# EAGLE design cbm_usb_v1.0a (EAGLE 6.4)

## Sheet 1 of 3
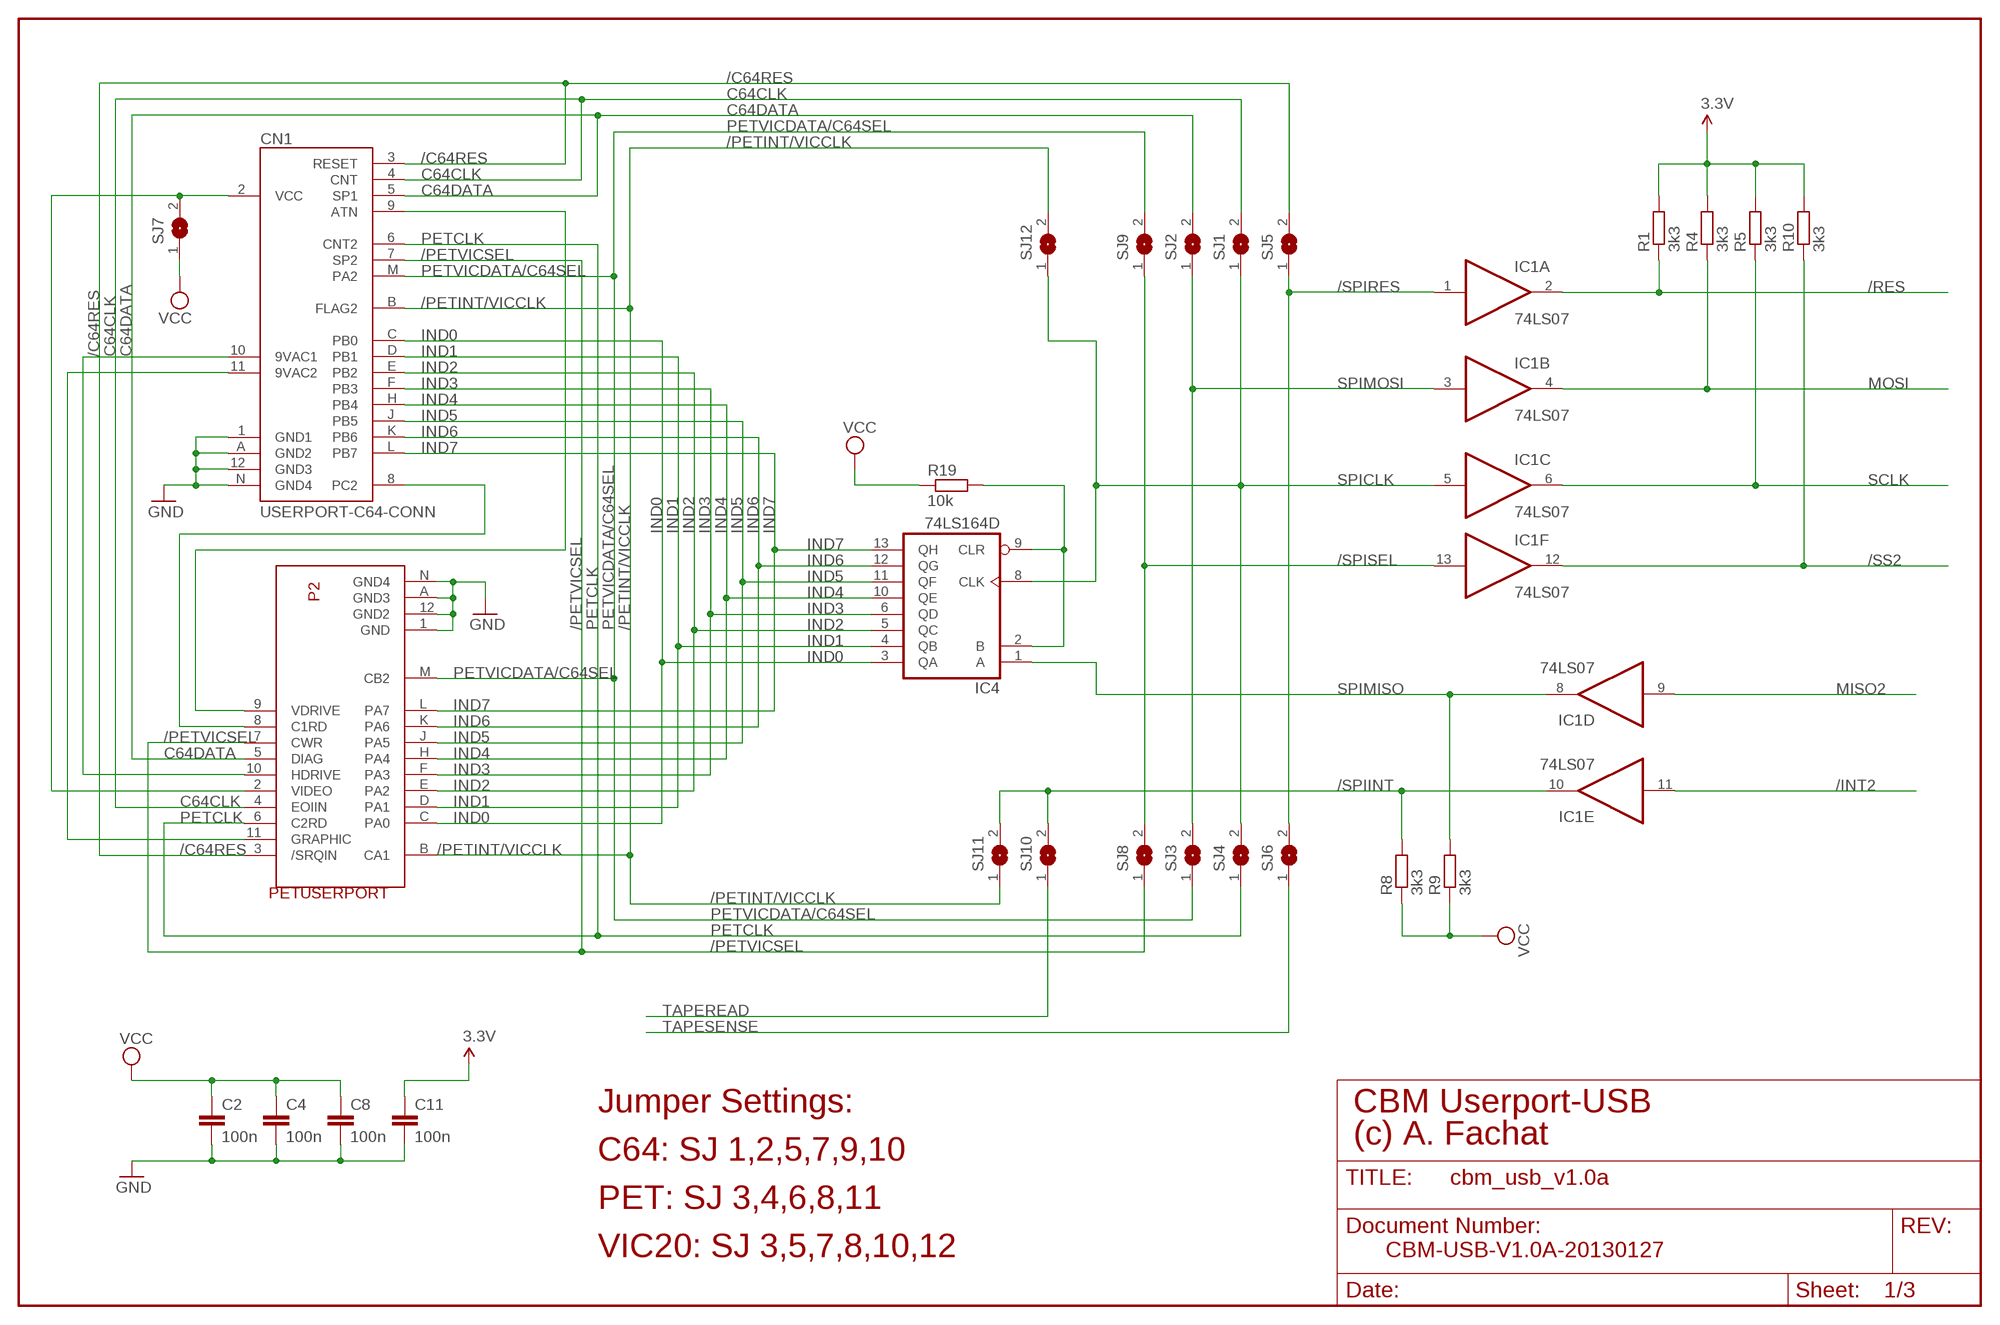
[diagram p0: schematic, sheet 1]

### Parts
C2  100n  C-EU050-025X075  [C050-025X075]
C4  100n  C-EU050-025X075  [C050-025X075]
C8  100n  C-EU050-025X075  [C050-025X075]
C11  100n  C-EU050-025X075  [C050-025X075]
CN1  USERPORT-C64-CONN  [UPS24CONN]
IC1  74LS07  74LS07D  [SO14]
IC4  74LS164D  [SO14]
P2  PETUSERPORT  [FLAT24]
R1  3k3  R-EU_0204/7  [0204/7]
R4  3k3  R-EU_0204/7  [0204/7]
R5  3k3  R-EU_0204/7  [0204/7]
R8  3k3  R-EU_0204/7  [0204/7]
R9  3k3  R-EU_0204/7  [0204/7]
R10  3k3  R-EU_0204/7  [0204/7]
R19  10k  R-EU_0204/7  [0204/7]
SJ1  SJW  [SJW]
SJ2  SJW  [SJW]
SJ3  SJW  [SJW]
SJ4  SJW  [SJW]
SJ5  SJW  [SJW]
SJ6  SJW  [SJW]
SJ7  SJW  [SJW]
SJ8  SJW  [SJW]
SJ9  SJW  [SJW]
SJ10  SJW  [SJW]
SJ11  SJW  [SJW]
SJ12  SJW  [SJW]

### Nets
3.3V: C11.1 R1.2 R4.2 R5.2 R10.2 ; also sheet 2,3
/C64RES: CN1.3(RESET) P2.3(/SRQIN) SJ5.2
/INT2: IC1.11(E:I) ; also sheet 2
/PETINT/VICCLK: CN1.B(FLAG2) P2.B(CA1) SJ11.1 SJ12.2
/PETVICSEL: CN1.7(SP2) P2.7(CWR) SJ8.1
/RES: IC1.2(A:O) R1.1 ; also sheet 2
/SPIINT: IC1.10(E:O) R8.2 SJ10.2 SJ11.2
/SPIRES: IC1.1(A:I) SJ5.1 SJ6.2
/SPISEL: IC1.13(F:I) SJ8.2 SJ9.1
/SS2: IC1.12(F:O) R10.1 ; also sheet 2
C64CLK: CN1.4(CNT) P2.4(EOIIN) SJ1.2
C64DATA: CN1.5(SP1) P2.5(DIAG) SJ2.2
GND: C2.2 C4.2 C8.2 C11.2 CN1.1(GND1) CN1.12(GND3) CN1.A(GND2) CN1.N(GND4) P2.1(GND) P2.12(GND2) P2.A(GND3) P2.N(GND4) ; also sheet 2,3
IND0: CN1.C(PB0) IC4.3(QA) P2.C(PA0)
IND1: CN1.D(PB1) IC4.4(QB) P2.D(PA1)
IND2: CN1.E(PB2) IC4.5(QC) P2.E(PA2)
IND3: CN1.F(PB3) IC4.6(QD) P2.F(PA3)
IND4: CN1.H(PB4) IC4.10(QE) P2.H(PA4)
IND5: CN1.J(PB5) IC4.11(QF) P2.J(PA5)
IND6: CN1.K(PB6) IC4.12(QG) P2.K(PA6)
IND7: CN1.L(PB7) IC4.13(QH) P2.L(PA7)
MISO2: IC1.9(D:I) ; also sheet 2
MOSI: IC1.4(B:O) R4.1 ; also sheet 2
N$1: CN1.10(9VAC1) P2.10(HDRIVE)
N$2: CN1.11(9VAC2) P2.11(GRAPHIC)
N$5: CN1.2(VCC) P2.2(VIDEO) SJ7.2
N$6: CN1.8(PC2) P2.8(C1RD)
N$7: CN1.9(ATN) P2.9(VDRIVE)
N$37: IC4.2(B) IC4.9(CLR) R19.2
PETCLK: CN1.6(CNT2) P2.6(C2RD) SJ4.1
PETVICDATA/C64SEL: CN1.M(PA2) P2.M(CB2) SJ3.1 SJ9.2
SCLK: IC1.6(C:O) R5.1 ; also sheet 2
SPICLK: IC1.5(C:I) IC4.8(CLK) SJ1.1 SJ4.2 SJ12.1
SPIMISO: IC1.8(D:O) IC4.1(A) R9.2
SPIMOSI: IC1.3(B:I) SJ2.1 SJ3.2
TAPEREAD: SJ10.1 ; also sheet 3
TAPESENSE: SJ6.1 ; also sheet 3
VCC: C2.1 C4.1 C8.1 R8.1 R9.1 R19.1 SJ7.1 ; also sheet 2,3

### Notes on the sheet
- Jumper Settings: | CBM Userport-USB
- (c) A. Fachat
- C64: SJ 1,2,5,7,9,10
- PET: SJ 3,4,6,8,11
- VIC20: SJ 3,5,7,8,10,12 | CBM-USB-V1.0A-20130127

## Sheet 2 of 3
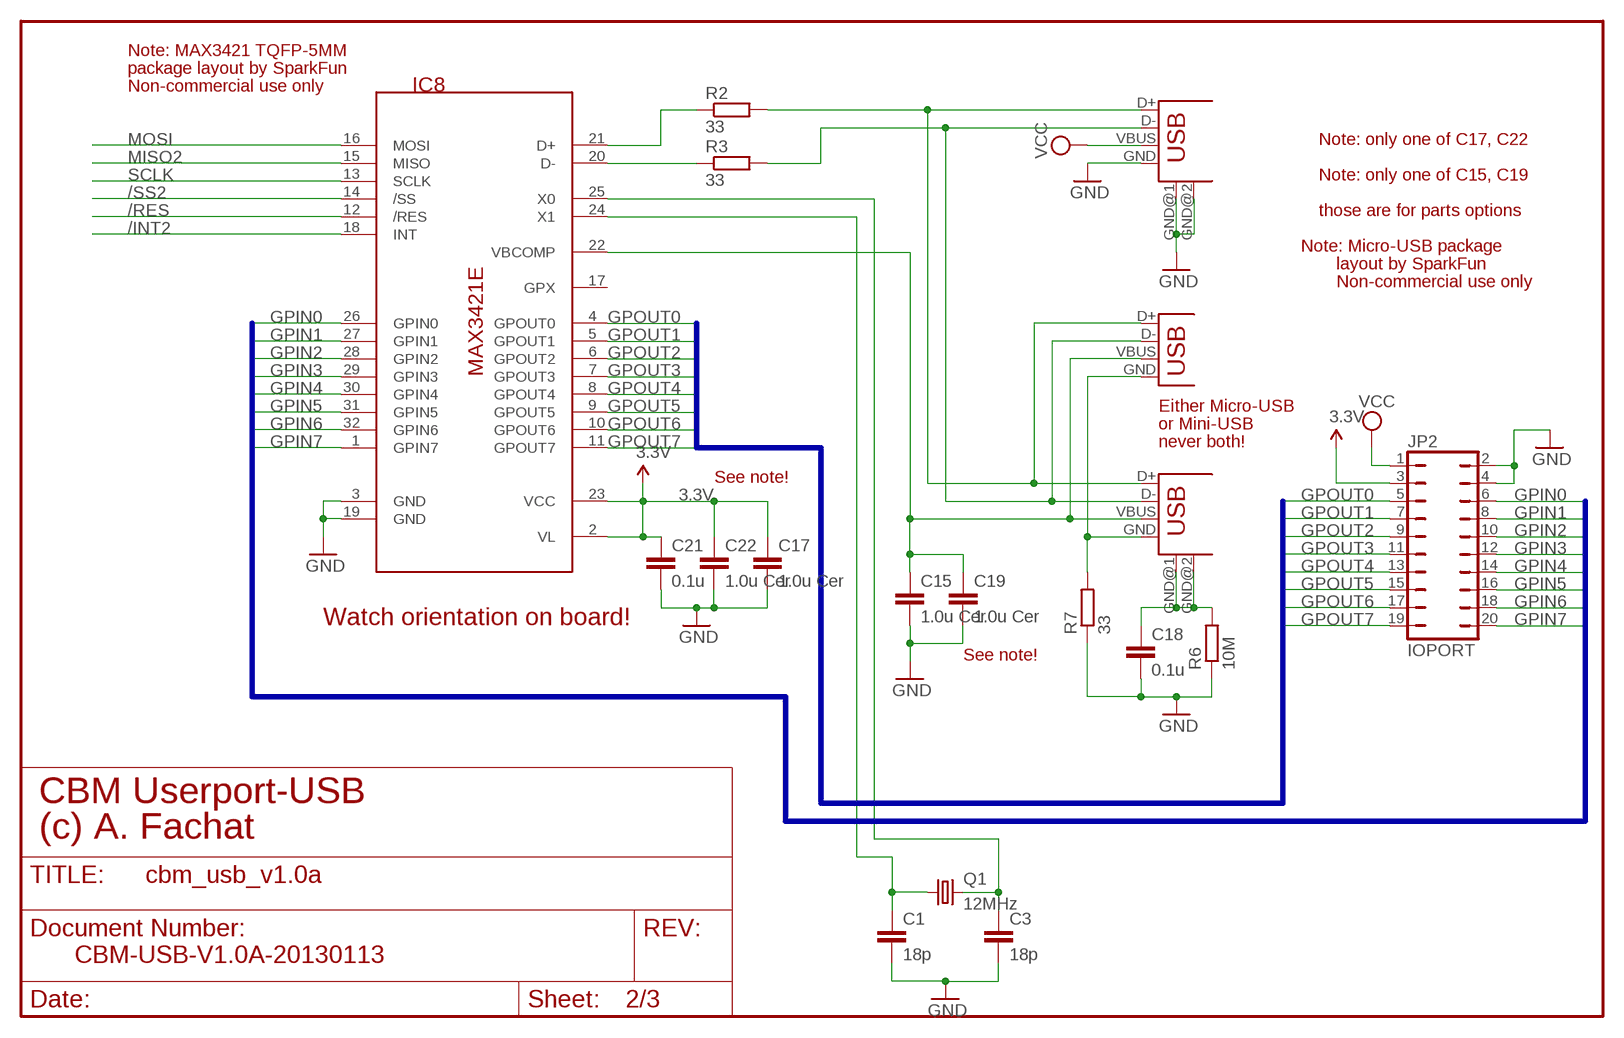
[diagram p1: schematic, sheet 2]

### Parts
C1  18p  C-EU050-025X075  [C050-025X075]
C3  18p  C-EU050-025X075  [C050-025X075]
C15  1.0u Cer  C-EUC0603  [C0603]
C17  1.0u Cer  C-EU050-024X044  [C050-024X044]
C18  0.1u  C-EU050-025X075  [C050-025X075]
C19  1.0u Cer  C-EU050-024X044  [C050-024X044]
C21  0.1u  C-EU050-025X075  [C050-025X075]
C22  1.0u Cer  C-EUC0603  [C0603]
IC8  MAX3421E  [TQFP32-5MM]
JP2  IOPORT  JP10Q  [JP10Q]
Q1  12MHz  CRYSTALHC49U70  [HC49U70]
R2  33  R-EU_0204/7  [0204/7]
R3  33  R-EU_0204/7  [0204/7]
R6  10M  R-EU_0204/7  [0204/7]
R7  33  R-EU_0204/7  [0204/7]
USB1  USB-A-H  [USB-A-H]
USB2  USB-MB-H  [USB-MB-H]
X1  USB-MICROB  [USB-MICROB]

### Nets
3.3V: C17.1 C21.1 C22.1 IC8.2(VL) IC8.23(VCC) JP2.3 ; also sheet 1,3
12MHZ: C1.1 IC8.24(X1) Q1.1
/INT2: IC8.18(INT) ; also sheet 1
/RES: IC8.12(/RES) ; also sheet 1
/SS2: IC8.14(/SS) ; also sheet 1
GND: C1.2 C3.2 C15.2 C17.2 C18.2 C19.2 C21.2 C22.2 IC8.3(GND) IC8.19(GND) JP2.2 JP2.4 R6.1 R7.1 USB1.GND USB1.GND@1(GND) USB1.GND@2(GND) ; also sheet 1,3
GPIN0: IC8.26(GPIN0) JP2.6
GPIN1: IC8.27(GPIN1) JP2.8
GPIN2: IC8.28(GPIN2) JP2.10
GPIN3: IC8.29(GPIN3) JP2.12
GPIN4: IC8.30(GPIN4) JP2.14
GPIN5: IC8.31(GPIN5) JP2.16
GPIN6: IC8.32(GPIN6) JP2.18
GPIN7: IC8.1(GPIN7) JP2.20
GPOUT0: IC8.4(GPOUT0) JP2.5
GPOUT1: IC8.5(GPOUT1) JP2.7
GPOUT2: IC8.6(GPOUT2) JP2.9
GPOUT3: IC8.7(GPOUT3) JP2.11
GPOUT4: IC8.8(GPOUT4) JP2.13
GPOUT5: IC8.9(GPOUT5) JP2.15
GPOUT6: IC8.10(GPOUT6) JP2.17
GPOUT7: IC8.11(GPOUT7) JP2.19
MISO2: IC8.15(MISO) ; also sheet 1
MOSI: IC8.16(MOSI) ; also sheet 1
N$3: IC8.20(D-) R3.1
N$4: IC8.21(D+) R2.1
N$9: R2.2 USB1.D+ USB2.D+ X1.D+
N$10: R3.2 USB1.D- USB2.D- X1.D-
N$11: C3.1 IC8.25(X0) Q1.2
N$13: R7.2 USB2.GND X1.GND
N$16: C18.1 R6.2 USB2.GND@1(GND) USB2.GND@2(GND)
SCLK: IC8.13(SCLK) ; also sheet 1
VBCOMP: C15.1 C19.1 IC8.22(VBCOMP) USB2.VBUS X1.VBUS
VCC: JP2.1 USB1.VBUS ; also sheet 1,3
Unconnected: IC8.17(GPX)

### Buses
GPIN[0..7]
GPOUT[0..7]

### Notes on the sheet
- Note: MAX3421 TQFP-5MM
- package layout by SparkFun
- Non-commercial use only
- Note: only one of C17, C22
- Note: only one of C15, C19
- those are for parts options
- Note: Micro-USB package
- layout by SparkFun
- Non-commercial use only
- Either Micro-USB
- or Mini-USB
- never both!
- See note!
- Watch orientation on board!
- See note!
- CBM Userport-USB
- (c) A. Fachat
- CBM-USB-V1.0A-20130113

## Sheet 3 of 3
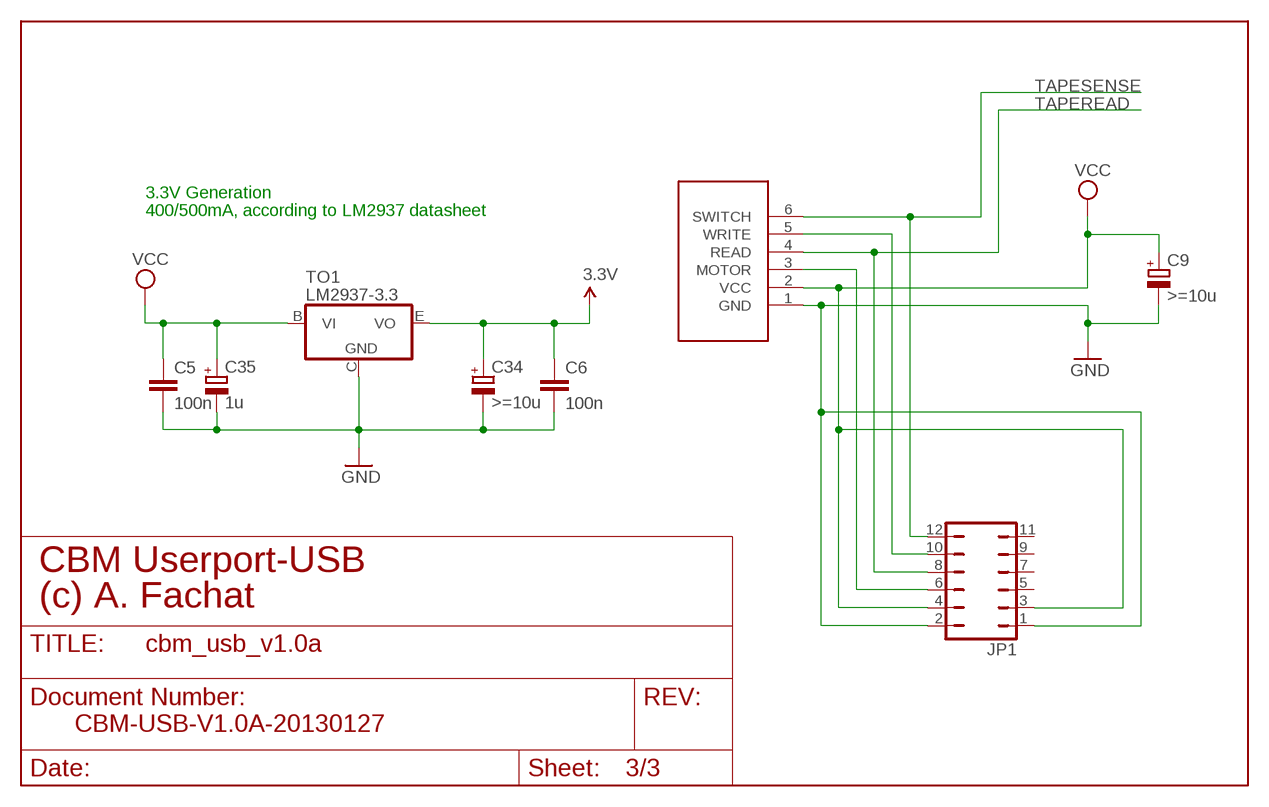
[diagram p2: schematic, sheet 3]

### Parts
C5  100n  C-EU050-025X075  [C050-025X075]
C6  100n  C-EU050-025X075  [C050-025X075]
C9  >=10u  CPOL-EUE5-10.5  [E5-10,5]
C34  >=10u  CPOL-EUE5-8.5  [E5-8,5]
C35  1u  CPOL-EUE5-8.5  [E5-8,5]
JP1  JP6Q  [JP6Q]
P3  CBMTAPE  [JP6]
TO1  LM2937-3.3  LM2937  [TO220H]

### Nets
3.3V: C6.1 C34.+ TO1.E(VO) ; also sheet 1,2
GND: C5.2 C6.2 C9.- C34.- C35.- JP1.1 JP1.2 P3.1(GND) TO1.C(GND) ; also sheet 1,2
N$8: JP1.6 P3.3(MOTOR)
N$12: JP1.10 P3.5(WRITE)
TAPEREAD: JP1.8 P3.4(READ) ; also sheet 1
TAPESENSE: JP1.12 P3.6(SWITCH) ; also sheet 1
VCC: C5.1 C9.+ C35.+ JP1.3 JP1.4 P3.2(VCC) TO1.B(VI) ; also sheet 1,2
Unconnected: JP1.5 JP1.7 JP1.9 JP1.11

### Notes on the sheet
- 3.3V Generation
- 400/500mA, according to LM2937 datasheet
- CBM Userport-USB
- (c) A. Fachat
- CBM-USB-V1.0A-20130127

## Power pins joined to a net without a drawn wire
GND: IC1.7(P:GND) IC4.7(GND)
VCC: IC1.14(P:VCC) IC4.14(VCC)

## Library data of the parts
C1-C6 C8 C11 C15 C17-C19 C21 C22 = rcl:C-EU: CAPACITOR, European symbol
C9 C34 C35 = rcl:CPOL-EU: POLARIZED CAPACITOR, European symbol
CN1 = 0RB_Commodore:USERPORT-C64-CONN
IC1 = 74xx-eu:74*07: Hex BUFFER, open collector high-voltage output
IC4 = 74xx-eu:74*164: 8-bit parallel out SHIFT REGISTER
IC8 = csa:MAX3421E
JP1 = jumper:JP6Q: JUMPER
JP2 = jumper:JP10Q: JUMPER
P2 = csa:PETUSERPORT
P3 = csa:CBMTAPE
Q1 = crystal:CRYSTAL: CRYSTAL; OC_FARNELL: unknown; OC_NEWARK: unknown
R1-R10 R19 = rcl:R-EU_: RESISTOR, European symbol
SJ1-SJ12 = jumper:SJ: SMD solder JUMPER
TO1 = csa:LM2937
USB1 USB2 = con-usb-2:USB: USB Connectors USB-B-PTH is fully proven SKU : PRT-00139 USB-miniB is fully proven SKU : PRT-00587 USB-A-PCB is untested. USB-A-H is throughly reviewed, but untested. Spark Fun Electronics SKU : PRT-00437 USB-B-SMT is throughly reviewed, but untested. Needs silkscreen touching up. USB-A-S has not been used/tested USB-MB-H has not been used/tested
X1 = SparkFun:USB: USB Connectors USB-B-PTH is fully proven SKU : PRT-00139 USB-miniB is fully proven SKU : PRT-00587 USB-A-PCB is untested. USB-A-H is throughly reviewed, but untested. Spark Fun Electronics SKU : PRT-00437 USB-B-SMT is throughly reviewed, but untested. Needs silkscreen touching up. USB-A-S has not been used/tested USB-MB-H has not been used/tested

## Board
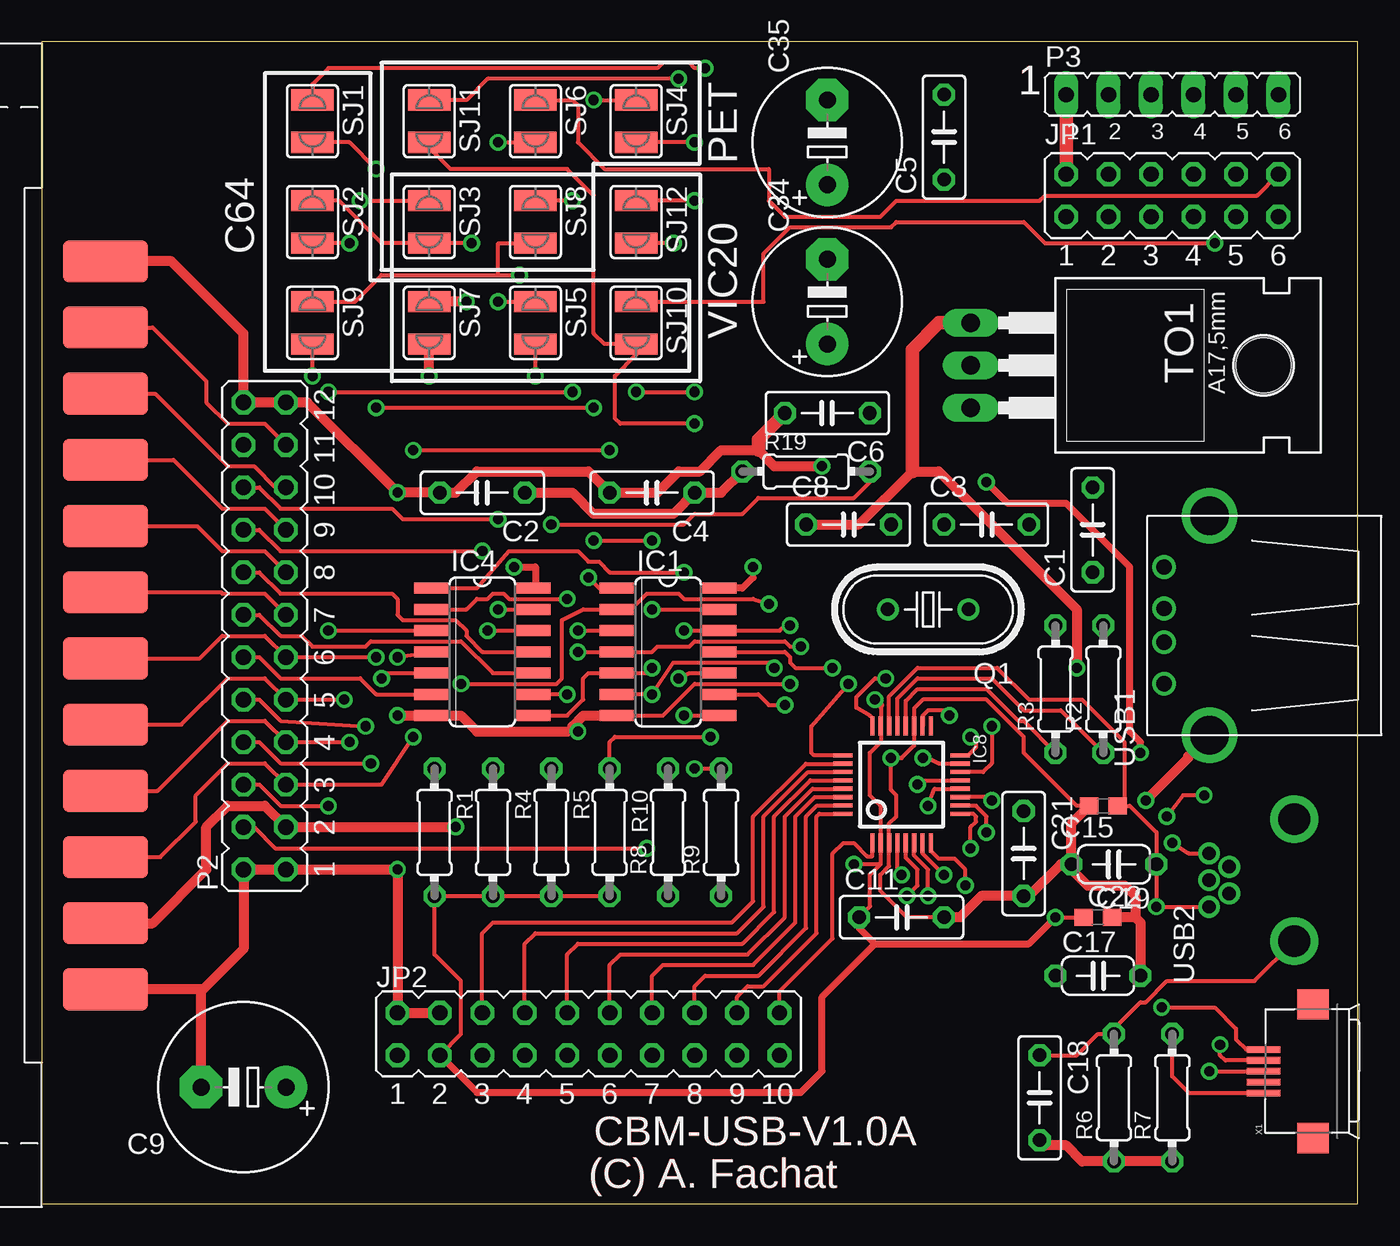
[diagram p3: board, top side]
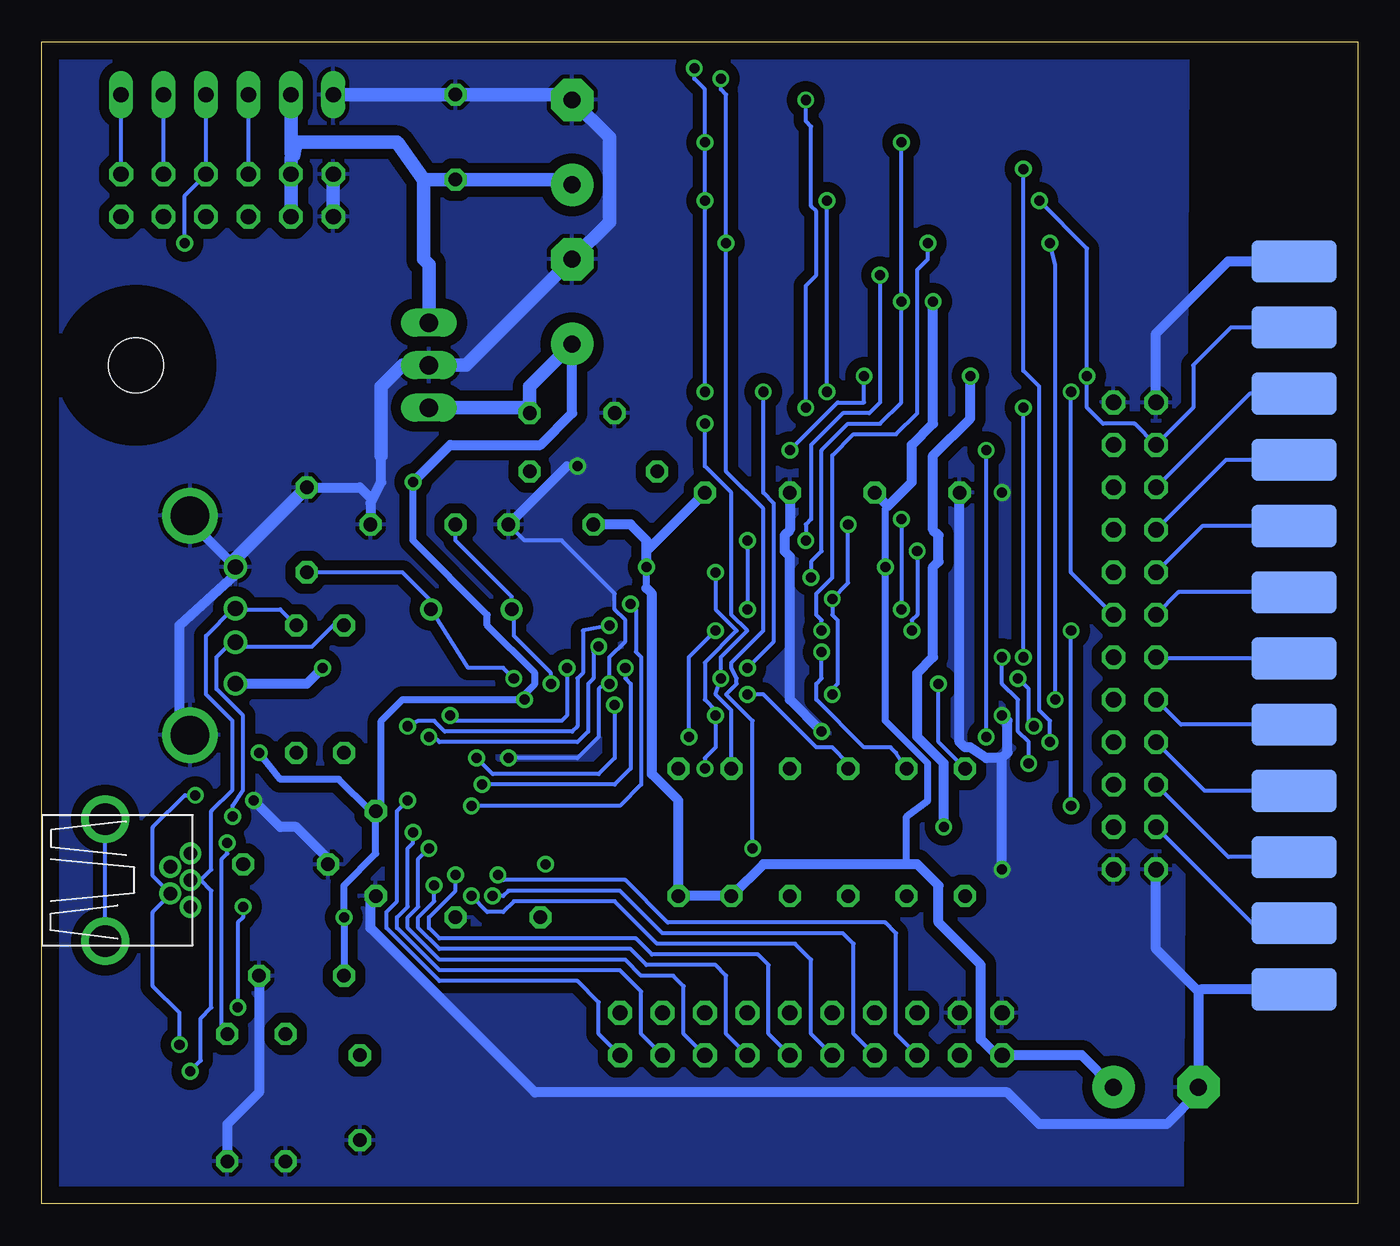
[diagram p4: board, bottom side, seen from below]

Size 78.72 x 69.52 mm. Coordinates in mm from the lower left corner, seen from the top.
Outline: 0,0 78.72,0 78.72,69.52 0,69.52 0,0
Copper layers (1*16): Top 0.035mm / dielectric 1.5mm / Bottom 0.035mm
Design rules "default *": minimum track width 10mil, minimum drill 12mil, track to track 6mil, track to pad 6mil, pad to pad 6mil, via to via 6mil, smd to smd 6mil, copper to edge 40mil, drill to drill 8mil, minimum pad ring 10mil, minimum via ring 8mil, stop-mask expansion 4mil, vias tented up to drill 0mil, thermal gap 10mil

### Footprints (pad centres in the part's own frame; a part is rotated, then mirrored left to right if it is on the bottom)
C050-025X075 = drill 0.813 octagon: 1 -2.54,0; 2 2.54,0
E5-10,5 = drill 1.016 pad 2.54: + -2.54,0 | drill 1.016 pad 2.54 octagon: - 2.54,0
C0603 = smd 1.1 x 1: 1 -0.85,0; 2 0.85,0
C050-024X044 = drill 0.813 octagon: 1 -2.54,0; 2 2.54,0
E5-8,5 = drill 1.016 pad 2.54: + -2.54,0 | drill 1.016 pad 2.54 octagon: - 2.54,0
UPS24CONN = smd 2.54 x 5.08: 1 -21.779,-1.27; 2 -17.819,-1.27; 3 -13.859,-1.27; 4 -9.899,-1.27; 5 -5.939,-1.27; 6 -1.979,-1.27; 7 1.981,-1.27; 8 5.941,-1.27; 9 9.901,-1.27; 10 13.861,-1.27; 11 17.821,-1.27; 12 21.781,-1.27 | smd 2.54 x 5.08 bottom: A -21.779,-1.27; B -17.819,-1.27; C -13.859,-1.27; D -9.899,-1.27; E -5.939,-1.27; F -1.979,-1.27; H 1.981,-1.27; J 5.941,-1.27; K 9.901,-1.27; L 13.861,-1.27; M 17.821,-1.27; N 21.781,-1.27
SO14 = smd 0.66 x 2.032: 1 -3.81,-3.073; 2 -2.54,-3.073; 3 -1.27,-3.073; 4 0,-3.073; 5 1.27,-3.073; 6 2.54,-3.073; 7 3.81,-3.073; 8 3.81,3.073; 9 2.54,3.073; 10 1.27,3.073; 11 0,3.073; 12 -1.27,3.073; 13 -2.54,3.073; 14 -3.81,3.073
TQFP32-5MM = smd 1.143 x 0.254: 1 -3.5,1.75; 2 -3.5,1.25; 3 -3.5,0.75; 4 -3.5,0.25; 5 -3.5,-0.25; 6 -3.5,-0.75; 7 -3.5,-1.25; 8 -3.5,-1.75; 17 3.5,-1.75; 18 3.5,-1.25; 19 3.5,-0.75; 20 3.5,-0.25; 21 3.5,0.25; 22 3.5,0.75; 23 3.5,1.25; 24 3.5,1.75 | smd 0.254 x 1.143: 9 -1.75,-3.5; 10 -1.25,-3.5; 11 -0.75,-3.5; 12 -0.25,-3.5; 13 0.25,-3.5; 14 0.75,-3.5; 15 1.25,-3.5; 16 1.75,-3.5; 25 1.75,3.5; 26 1.25,3.5; 27 0.75,3.5; 28 0.25,3.5; 29 -0.25,3.5; 30 -0.75,3.5; 31 -1.25,3.5; 32 -1.75,3.5
JP6Q = drill 0.914 octagon: 1 -6.35,-1.27; 2 -6.35,1.27; 3 -3.81,-1.27; 4 -3.81,1.27; 5 -1.27,-1.27; 6 -1.27,1.27; 7 1.27,-1.27; 8 1.27,1.27; 9 3.81,-1.27; 10 3.81,1.27; 11 6.35,-1.27; 12 6.35,1.27
JP10Q = drill 0.914 octagon: 1 -11.43,-1.27; 2 -11.43,1.27; 3 -8.89,-1.27; 4 -8.89,1.27; 5 -6.35,-1.27; 6 -6.35,1.27; 7 -3.81,-1.27; 8 -3.81,1.27; 9 -1.27,-1.27; 10 -1.27,1.27; 11 1.27,-1.27; 12 1.27,1.27; 13 3.81,-1.27; 14 3.81,1.27; 15 6.35,-1.27; 16 6.35,1.27; 17 8.89,-1.27; 18 8.89,1.27; 19 11.43,-1.27; 20 11.43,1.27
FLAT24 = drill 0.914 octagon: 1 -13.97,-1.27; 2 -11.43,-1.27; 3 -8.89,-1.27; 4 -6.35,-1.27; 5 -3.81,-1.27; 6 -1.27,-1.27; 7 1.27,-1.27; 8 3.81,-1.27; 9 6.35,-1.27; 10 8.89,-1.27; 11 11.43,-1.27; 12 13.97,-1.27; A -13.97,1.27; B -11.43,1.27; C -8.89,1.27; D -6.35,1.27; E -3.81,1.27; F -1.27,1.27; H 1.27,1.27; J 3.81,1.27; K 6.35,1.27; L 8.89,1.27; M 11.43,1.27; N 13.97,1.27
JP6 = drill 0.914 long: 1 -7.62,1.27; 2 -5.08,1.27; 3 -2.54,1.27; 4 0,1.27; 5 2.54,1.27; 6 5.08,1.27
HC49U70 = drill 0.813: 1 -2.413,0; 2 2.413,0
0204/7 = drill 0.813 octagon: 1 -3.81,0; 2 3.81,0
SJW = smd 1.27 x 2.54: 1 -1.27,0; 2 1.27,0
TO220H = drill 1.118 long: B -2.54,-10.16; C 0,-10.16; E 2.54,-10.16 | hole 3.302: 0,7.366
USB-A-H = drill 0.914: D+ 2.718,-1.003; D- 2.718,1.003; GND 2.718,-3.493; VBUS 2.718,3.493 | drill 2.311: GND@1 0,6.566; GND@2 0,-6.566
USB-MB-H = drill 0.8: D+ 5.1,0; D- 3.9,0.8; GND 5.1,-1.6; ID 3.9,-0.8; VBUS 5.1,1.6 | drill 1.9: GND@1 0,3.65; GND@2 0,-3.65
USB-MICROB = smd 0.4 x 2: D+ 0,3.1; D- 0.65,3.1; GND -1.3,3.1; ID -0.65,3.1; VBUS 1.3,3.1 | smd 1.8 x 1.9: GND@2 -4,0.15; GND@3 4,0.15

### Placement (x,y rotation side)
C1  62.86,40.32 90 top
C2  26.35,42.55 180 top
C3  56.52,40.64 0 top
C4  36.51,42.55 180 top
C5  53.97,63.82 90 top
C6  46.99,47.31 180 top
C8  48.26,40.64 0 top
C9  12.06,6.98 180 top
C11  51.43,17.14 0 top
C15  63.5,23.81 180 top
C17  63.18,13.65 0 top
C18  59.69,6.35 270 top
C19  64.14,20.32 180 top
C21  58.74,20.96 270 top
C22  63.18,17.14 0 top
C34  46.99,53.97 90 top
C35  46.99,63.5 90 top
CN1  2.54,34.61 90 top
IC1  37.46,33.02 270 top
IC4  26.35,33.02 270 top
IC8  51.43,25.08 90 top
JP1  67.63,60.32 0 top
JP2  32.7,10.16 0 top
P2  13.33,33.97 90 top
P3  68.9,65.09 0 top
Q1  53.02,35.56 180 top
R1  23.5,22.22 270 top
R2  63.5,30.8 90 top
R3  60.64,30.8 90 top
R4  26.99,22.22 270 top
R5  30.48,22.22 270 top
R6  64.14,6.35 90 top
R7  67.63,6.35 90 top
R8  37.46,22.22 90 top
R9  40.64,22.22 90 top
R10  33.97,22.22 270 top
R19  45.72,43.81 0 top
SJ1  16.19,64.77 270 top
SJ2  16.19,58.74 270 top
SJ3  23.18,58.74 270 top
SJ4  35.56,64.77 270 top
SJ5  29.53,52.7 270 top
SJ6  29.53,64.77 270 top
SJ7  23.18,52.7 270 top
SJ8  29.53,58.74 270 top
SJ9  16.19,52.7 270 top
SJ10  35.56,52.7 270 top
SJ11  23.18,64.77 270 top
SJ12  35.56,58.74 270 top
TO1  65.72,50.16 270 top
USB1  69.85,34.61 180 top
USB2  74.93,19.37 180 top
X1  76.2,7.94 90 top

### Tracks (layer width: path | path; a pad name or v marks a point on that pad's centre or on a via)
3.3V  (via drill 0.6)
  Top 0.254: JP2.3 25.08,10.16 25.08,13.33 23.49,14.92 R1.2 R4.2 R5.2 R10.2 | 50.17,20.32 49.53,19.68 49.55,17.8 C11.1 | 50.17,20.32 50.18,20.32 IC8.2 50.18,23.81 | 50.18,23.81 49.85,24.13 49.53,24.45 49.53,26.99 50.18,27.64 IC8.23 50.18,29.82 | 50.18,23.81 50.17,23.81 | 50.17,20.32 v48.58,20.32 | v60.64,17.14 C22.1
  Top 0.406: v49.85,30.16 50.18,29.82 | v56.52,43.18 57.78,41.91 61.28,41.91 65.09,38.1 65.09,28.26 65.72,27.62 v65.72,26.99 | C11.1 48.89,16.51 49.85,15.56 | 49.85,15.56 59.06,15.56 v60.64,17.14 | 49.85,15.56 46.67,12.38 46.67,7.94 45.4,6.67 26.03,6.67 JP2.3
  Top 0.813: TO1.E 55.24,47.31
  Bottom 0.254: v49.85,30.16 49.85,30.48
  Bottom 0.406: 49.85,30.48 49.21,31.11 49.21,31.75 52.07,34.61 52.07,35.24 56.52,39.69 v56.52,43.18 | C21.1 58.74,20.96 60.64,19.05 v60.64,17.14 C17.1 | C21.1 59.06,23.5 60.96,25.4 64.45,25.4 v65.72,26.99 | v49.85,30.16 57.15,30.16 58.42,28.89 58.42,23.81 C21.1
  Bottom 0.61: v56.52,43.18 54.29,45.4 48.89,45.4 46.99,47.31 C34.+
  Bottom 0.813: TO1.E 49.85,47.62 C6.1 49.53,48.89 C34.+
12MHZ  (via drill 0.6)
  Top 0.254: IC8.24 49.68,29.05 49.53,29.21 48.73,29.69 48.73,30.32 49.85,31.43 v50.48,31.43
  Bottom 0.254: v50.48,31.43 51.12,32.07 53.21,32.07 Q1.1 55.44,36.07 57.15,37.78 C1.1
/C64RES  (via drill 0.6)
  Top 0.254: CN1.3 7.1,20.75 9.21,22.86 9.21,24.45 11.11,26.35 13.33,26.35 P2.3 20.32,25.08 v22.23,27.94 | v22.23,45.08 v33.97,45.08 | v29.53,49.53 SJ5.2
  Bottom 0.254: v22.23,27.94 v22.23,45.08 | v33.97,45.08 31.12,47.94 29.53,47.94 v29.53,49.53
/INT2  (via drill 0.6)
  Top 0.254: IC1.11 44.45,33.02 44.77,32.7 44.77,32.39 45.09,32.07 v47.31,32.07 | v54.29,29.21 53.97,29.53 53.02,29.53 52.71,29.21 52.71,28.6 IC8.18
  Bottom 0.254: v47.31,32.07 47.31,29.21 47.63,28.89 53.97,28.89 v54.29,29.21
/PETINT/VICCLK  (via drill 0.6)
  Top 0.254: SJ11.1 25.4,66.04 26.67,67.31 v38.1,67.31 | P2.B 12.7,22.54 13.97,21.27 v36.2,21.27 | v37.78,57.47 SJ12.2
  Bottom 0.254: CN1.B 6.31,16.79 P2.B | v36.2,21.27 36.2,28.89 37.78,30.48 37.15,31.11 37.15,31.43 37.46,32.07 37.46,32.39 35.56,34.29 35.56,41.59 37.78,43.81 v37.78,57.47 37.78,66.36 38.1,66.67 v38.1,67.31
/PETVICSEL  (via drill 0.6)
  Top 0.254: CN1.7 10.72,36.59 10.8,36.51 13.33,36.51 P2.7 | v31.75,60.01 SJ8.1 | v17.14,48.58 v31.75,48.58
  Bottom 0.254: v31.75,48.58 v31.75,60.01 | v17.14,48.58 17.14,37.78 P2.7
/RES  (via drill 0.6)
  Top 0.254: v25.08,31.11 30.8,31.11 31.12,31.43 31.12,34.92 32.39,35.56 IC1.2 35.24,35.56 36.2,36.51 38.1,36.51 38.42,36.19 42.54,36.19 v43.5,35.88 | IC8.12 53.41,24.83 v53.02,23.81
  Bottom 0.254: v25.08,31.11 25.08,27.62 R1.1 | v53.02,23.81 44.13,23.81 42.86,25.08 42.86,32.7 43.18,33.02 43.18,35.56 v43.5,35.88
/SPIINT  (via drill 0.6)
  Top 0.254: SJ11.2 23.18,63.18 24.45,61.91 31.43,61.91 33.02,60.32 33.02,52.07 33.65,51.43 SJ10.2 35.56,50.8 34.29,49.53 34.29,46.99 34.61,46.67 v39.05,46.67 | v38.1,31.43 38.74,31.75 IC1.10
  Bottom 0.254: R8.2 37.46,29.53 38.42,30.48 v38.1,31.43 38.1,32.7 36.51,34.29 37.46,35.24 37.46,42.55 39.05,44.13 v39.05,46.67
/SPIRES  (via drill 0.6)
  Top 0.254: v27.3,63.5 SJ6.2 | v27.3,53.97 SJ5.1 | v32.7,37.47 33.34,36.83 IC1.1
  Bottom 0.254: v32.7,37.47 32.7,38.42 32.07,39.05 32.07,45.08 30.48,46.67 28.57,46.67 27.3,47.94 v27.3,53.97 v27.3,63.5
/SPISEL  (via drill 0.6)
  Top 0.254: SJ9.1 18.73,53.97 20.32,55.56 27.3,55.56 | 27.3,55.56 27.3,57.47 SJ8.2 | 27.3,55.56 v28.57,55.56 | v33.02,39.69 v36.51,39.69 | v36.51,35.56 IC1.13
  Bottom 0.254: v33.02,39.69 33.02,40.64 32.7,40.96 32.7,45.4 30.8,47.31 29.21,47.31 28.57,47.94 v28.57,55.56 | v36.51,39.69 v36.51,35.56
/SS2  (via drill 0.6)
  Top 0.254: R10.1 33.97,27.62 34.29,27.94 v40,27.94 | v38.42,34.29 IC1.12 44.13,34.29 44.45,34.61 v44.77,34.61 | IC8.14 56.31,25.83 56.83,26.35 v56.83,28.57
  Bottom 0.254: v40,27.94 40,32.7 v38.42,34.29 | v44.77,34.61 46.35,34.29 46.35,31.75 46.67,31.43 46.67,28.57 46.99,28.26 54.61,28.26 55.24,28.89 56.2,28.89 v56.83,28.57
C64CLK  (via drill 0.6)
  Top 0.254: CN1.4 6.93,24.71 11.11,28.89 13.33,28.89 P2.4 v18.42,27.62 | SJ1.2 18.42,63.5 v20,61.91
  Bottom 0.254: v18.42,27.62 18.42,28.89 19.05,29.53 19.05,48.89 20,49.85 v20,61.91
C64DATA  (via drill 0.6)
  Top 0.254: CN1.5 8.35,28.67 11.11,31.43 13.33,31.43 P2.5 v18.1,30.16 | v18.42,57.47 SJ2.2
  Bottom 0.254: v18.42,57.47 18.1,56.2 v18.1,30.16
GND  (via drill 0.6)
  Top 0.254: 9.52,12.7 9.65,12.83 | 31.43,28.26 31.75,28.57 | IC1.7 37.15,29.21 39.05,31.11 v44.77,31.11 | C11.2 51.75,17.14 50.17,18.73 50.17,19.68 50.68,20.21 IC8.3 50.68,22.75 51.12,23.18 51.12,24.45 50.8,24.76 v50.8,26.67 51.43,26.67 52.18,27.42 IC8.19 52.18,29.64 52.71,30.16 56.52,30.16 58.74,27.94 58.74,26.99 61.91,23.81 C15.2 | C21.2 59.06,18.41 | C19.2 61.6,20
  Top 0.61: CN1.N 7.75,56.39 12.07,52.07 P2.N P2.12 15.87,47.94 v21.27,42.55 C2.2 24.76,42.55 26.03,43.81 32.7,43.81 C4.2 36.83,42.55 38.1,43.81 39.37,43.81 40.64,45.08 42.86,45.08 43.82,44.13 v46.67,44.13 | CN1.A 9.65,12.83 12.07,15.24 P2.A P2.1 v21.27,20 JP2.2 JP2.4 | C9.- 9.52,12.7 | v21.27,29.21 IC4.7 25.08,29.21 26.03,28.26 31.43,28.26 | IC1.7 32.39,29.21 31.75,28.57 v32.07,28.26 | C11.2 54.93,17.14 56.2,18.41 C21.2 | 59.06,18.41 60.96,20.32 C19.2 61.6,22.76 C15.2 | 65.4,17.14 C22.2 | 65.4,17.14 65.72,16.83 C17.2 | 61.6,20 62.55,19.05 64.77,19.05 65.4,18.41 65.4,17.14 | R7.1 R6.1 62.23,2.54 61.28,3.49 60.01,3.49 C18.2 | v66.04,24.13 68.58,26.67 68.58,26.77 USB1.GND@1
  Top 0.813: P3.1 JP1.2 | 42.86,45.08 42.86,45.72 C6.2
  Bottom 0.254: CN1.N 3.94,56.52 | 9.4,12.83 9.52,12.7 | v50.8,26.67 46.67,26.67 45.4,27.94 45.4,30.8 45.09,31.11 v44.77,31.11 44.77,32.7 43.82,33.66 43.82,34.92 44.45,35.56 44.45,36.51 47.63,39.69 49.85,39.69 C8.2 | v46.67,44.13 47.31,44.13 | 59.06,42.23 59.06,41.91 | 69.85,40.82 USB1.GND@2
  Bottom 0.61: CN1.A 9.4,12.83 | v21.27,20 21.27,26.67 | 21.27,26.67 20.96,26.99 20.96,28.89 v21.27,29.21 | 47.31,44.13 C8.2 | C3.2 59.06,41.91 58.42,43.18 58.42,44.77 | 59.06,42.23 59.69,42.86 C1.2 | CN1.N 7.75,56.39 12.07,52.07 P2.N | C2.2 23.81,27.62 23.49,27.3 23.18,27.3 22.23,26.67 21.27,26.67 | C4.2 33.97,40.32 34.29,40 34.29,39.05 33.97,38.73 33.97,30.16 v32.07,28.26 | 69.85,40.82 USB1.GND 67.13,37.64 70.48,34.61 70.48,28.57 69.95,28.04 USB1.GND@1 | C17.2 65.72,6.67 67.63,4.76 R7.1 | P2.A 12.07,15.24 9.52,12.7 C9.- 9.52,6.67 11.43,4.76 19.05,4.76 20.96,6.67 49.21,6.67 59.06,16.51 59.06,18.1 C21.2 | C19.2 61.6,20.64 63.5,22.54 64.45,22.54 v66.04,24.13
  Bottom 0.813: JP1.2 JP1.1 | P3.1 C5.2 47.31,66.36 C35.- 44.77,63.82 44.77,58.74 C34.- 53.34,50.16 TO1.C 57.15,50.16 58.42,48.89 58.42,44.77 | USB1.GND 67.13,38.59 C1.2
  pour Bottom (isolate 0.61): 10.16,68.58 77.79,68.58 77.79,0.63 10.48,0.63
GPIN0
  Top 0.254: IC8.26 45.7,26.33 42.54,23.18 42.54,18.1 41.28,16.83 26.99,16.83 26.35,16.19 JP2.6
GPIN1
  Top 0.254: IC8.27 45.84,25.83 43.18,23.18 43.18,17.78 41.59,16.19 29.53,16.19 28.89,15.56 JP2.8
GPIN2
  Top 0.254: IC8.28 45.97,25.33 43.82,23.18 43.82,17.46 41.91,15.56 32.07,15.56 31.43,14.92 JP2.10
GPIN3
  Top 0.254: IC8.29 46.1,24.83 44.45,23.18 44.45,17.14 42.23,14.92 34.61,14.92 33.97,14.29 JP2.12
GPIN4
  Top 0.254: IC8.30 46.24,24.33 45.09,23.18 45.09,16.83 42.54,14.29 37.15,14.29 36.51,13.65 JP2.14
GPIN5
  Top 0.254: IC8.31 46.38,23.83 45.72,23.18 45.72,16.51 42.86,13.65 39.69,13.65 39.05,13.02 JP2.16
GPIN6
  Top 0.254: IC8.32 46.51,23.33 46.35,23.18 46.35,16.19 43.18,13.02 42.23,13.02 41.59,12.38 JP2.18
GPIN7
  Top 0.254: JP2.20 44.13,12.7 47.31,15.87 47.31,20.96 47.94,21.59 48.58,21.59 49.38,20.79 49.68,20.79 IC8.1
GPOUT0  (via drill 0.6)
  Top 0.254: IC8.4 51.18,19.93 v51.43,19.68
  Bottom 0.254: JP2.5 27.62,10.16 27.62,16.19 28.26,16.83 41.28,16.83 43.82,19.37 51.12,19.37 v51.43,19.68
GPOUT1  (via drill 0.6)
  Top 0.254: IC8.5 51.68,20.71 52.39,20 52.39,19.05 v51.75,18.41
  Bottom 0.254: JP2.7 30.16,10.16 30.16,15.56 30.8,16.19 41.59,16.19 44.13,18.73 50.8,18.73 51.12,18.41 v51.75,18.41
GPOUT2  (via drill 0.6)
  Top 0.254: IC8.6 52.18,20.84 53.02,20 v53.02,18.41
  Bottom 0.254: JP2.9 32.7,10.16 32.7,14.6 33.65,15.56 41.91,15.56 44.45,18.1 50.48,18.1 51.12,17.46 52.07,17.46 v53.02,18.41
GPOUT3  (via drill 0.6)
  Top 0.254: IC8.7 52.68,20.97 v53.97,19.68
  Bottom 0.254: JP2.11 35.24,10.16 35.24,14.29 35.88,14.92 42.23,14.92 43.18,15.87 54.93,15.87 55.56,16.51 55.56,17.14 53.97,18.73 v53.97,19.68
GPOUT4  (via drill 0.6)
  Top 0.254: IC8.8 53.18,21.11 53.66,20.64 54.61,20.64 55.24,20 v55.24,19.05
  Bottom 0.254: JP2.13 37.78,10.16 37.78,13.65 38.42,14.29 42.54,14.29 43.5,15.24 54.93,15.24 56.2,16.51 56.2,17.14 55.24,18.1 v55.24,19.05
GPOUT5  (via drill 0.6)
  Top 0.254: IC8.9 55.72,23.33 55.88,23.18 55.88,22.86 55.56,22.54 v55.56,21.27
  Bottom 0.254: JP2.15 40.32,10.16 40.32,13.02 40.96,13.65 42.86,13.65 43.82,14.6 54.93,14.6 56.83,16.51 56.83,17.14 56.2,17.78 56.2,20.64 v55.56,21.27
GPOUT6  (via drill 0.6)
  Top 0.254: IC8.10 54.96,23.81 55.88,23.81 56.52,23.18 v56.52,22.22
  Bottom 0.254: JP2.17 42.86,10.16 42.86,12.7 44.13,13.97 54.93,13.97 57.47,16.51 57.47,17.14 56.83,17.78 56.83,21.27 56.52,21.59 v56.52,22.22
GPOUT7  (via drill 0.6)
  Top 0.254: IC8.11 56.63,24.33 v56.83,24.13
  Bottom 0.254: JP2.19 45.4,10.16 45.4,12.06 46.67,13.33 54.93,13.33 58.1,16.51 58.1,17.46 57.47,18.1 57.47,23.5 v56.83,24.13
IND0  (via drill 0.6)
  Top 0.254: v17.14,34.29 IC4.3 | v17.14,23.81 14.29,23.81 13.02,25.08 P2.C
  Bottom 0.254: CN1.C 7.73,20.75 P2.C | v17.14,23.81 v17.14,34.29
IND1  (via drill 0.6)
  Top 0.254: v21.27,32.7 IC4.4 | v19.69,26.35 14.29,26.35 13.02,27.62 P2.D
  Bottom 0.254: CN1.D 9.15,24.71 P2.D | v21.27,32.7 21.27,31.11 20.32,30.16 20.32,28.26 19.69,27.62 v19.69,26.35
IND2  (via drill 0.6)
  Top 0.254: P2.E 13.02,30.16 14.29,28.89 v19.37,28.57 | v20.32,31.43 20.64,31.75 IC4.5
  Bottom 0.254: CN1.E 10.57,28.67 P2.E | v19.37,28.57 19.69,28.89 19.69,30.8 v20.32,31.43
IND3
  Top 0.254: IC4.6 20,30.48 19.05,31.43 14.29,31.43 13.02,32.7 P2.F
  Bottom 0.254: CN1.F 11.99,32.63 P2.F
IND4
  Top 0.254: P2.H 13.02,35.24 14.29,33.97 15.56,33.97 16.19,33.34 19.37,33.34 19.69,33.66 25.08,33.66 26.99,31.75 IC4.10
  Bottom 0.254: CN1.H 10.72,36.59 P2.H
IND5
  Top 0.254: P2.J 13.02,37.78 14.29,36.51 20.96,36.51 21.27,36.19 21.27,35.24 21.59,34.92 24.76,34.92 25.4,34.29 25.4,33.97 26.35,33.02 IC4.11
  Bottom 0.254: CN1.J 9.3,40.55 P2.J
IND6  (via drill 0.6)
  Top 0.254: P2.K 13.02,40.32 14.29,39.05 v26.35,39.05 | v26.67,34.29 IC4.12
  Bottom 0.254: CN1.K 7.88,44.51 P2.K | v26.35,39.05 26.35,35.24 26.67,34.92 v26.67,34.29
IND7  (via drill 0.6)
  Top 0.254: P2.L 13.02,42.86 14.29,41.59 20.96,41.59 21.59,40.96 v27.3,40.96 | v27.3,35.56 IC4.13
  Bottom 0.254: CN1.L 6.46,48.47 P2.L | v27.3,40.96 v27.3,35.56
MISO2  (via drill 0.6)
  Top 0.254: IC1.9 42.86,30.48 43.5,29.84 v44.45,29.84 | v52.71,26.67 53.02,26.67 53.66,26.35 54.92,26.35 IC8.15
  Bottom 0.254: v44.45,29.84 44.45,26.67 45.4,25.72 51.75,25.72 v52.71,26.67
MOSI  (via drill 0.6)
  Top 0.254: v32.07,33.02 IC1.4 36.51,33.02 36.83,33.34 38.74,33.34 39.05,33.66 44.45,33.66 44.77,33.34 v45.4,33.34 | IC8.16 55.41,26.83 55.88,27.3 55.88,27.62 v55.56,27.94
  Bottom 0.254: v32.07,33.02 32.07,31.43 32.39,31.11 32.39,30.16 29.53,27.3 27.94,27.3 27.62,26.99 R4.1 | v45.4,33.34 45.72,33.02 45.72,31.43 46.04,31.11 46.04,28.26 46.67,27.62 54.93,27.62 55.24,27.94 v55.56,27.94
N$1
  Top 0.254: CN1.10 6.78,48.47 11.11,44.13 12.7,44.13 13.97,42.86 P2.10
N$2
  Top 0.254: CN1.11 6.63,52.43 9.84,49.21 9.84,47.94 11.11,46.67 13.33,46.67 P2.11
N$3
  Top 0.254: IC8.20 51.68,30.09 52.39,30.8 56.52,30.8 58.42,28.89 58.74,28.89 R3.1
N$4
  Top 0.254: IC8.21 51.18,30.23 52.39,31.43 56.83,31.43 58.74,29.53 60.96,29.53 R2.1
N$5  (via drill 0.6)
  Top 0.61: CN1.2 6.63,16.79 9.84,20 9.84,22.54 11.11,23.81 13.33,23.81 P2.2 v24.76,22.54 | v23.18,49.53 SJ7.2
  Bottom 0.61: v24.76,22.54 24.76,26.35 26.35,27.94 26.35,31.75 25.4,32.7 25.4,38.1 25.08,38.42 25.08,40 25.4,40.32 25.4,44.77 23.18,46.99 v23.18,49.53
N$6
  Top 0.254: CN1.8 9.3,40.55 10.8,39.05 13.33,39.05 P2.8
N$7
  Top 0.254: CN1.9 7.88,44.51 10.8,41.59 13.33,41.59 P2.9
N$8
  Bottom 0.254: JP1.6 P3.3
N$9  (via drill 0.6)
  Top 0.254: v69.85,7.94 X1.D+
  Bottom 0.254: R2.2 64.45,35.56 67.08,35.56 USB1.D+ 67.26,35.61 68.9,33.97 68.9,30.48 67.31,28.89 67.31,28.26 67.31,27.94 67.31,24.76 68.58,23.5 68.58,20 69.21,19.37 | 69.21,19.37 USB2.D+ | 69.21,19.37 68.58,18.73 68.58,11.75 69.21,11.11 69.21,8.57 v69.85,7.94
N$10  (via drill 0.6)
  Top 0.254: v69.53,24.45 68.26,24.45 v67.31,23.18 | v70.48,9.52 70.48,8.89 70.8,8.57 73.09,8.57 X1.D-
  Bottom 0.254: R3.2 61.28,34.61 62.55,33.34 66.87,33.34 USB1.D- 67.36,33.6 68.26,32.7 68.26,30.8 66.68,29.21 66.68,24.76 67.31,23.81 v67.31,23.18 | v69.53,24.45 70.17,24.45 72.07,22.54 72.07,19.61 USB2.D- 71.03,18.5 72.07,17.46 72.07,13.02 70.48,11.43 v70.48,9.52
N$11  (via drill 0.6)
  Top 0.254: IC8.25 46.19,26.83 46.04,26.99 46.04,28.57 v48.26,31.11
  Bottom 0.254: v48.26,31.11 48.26,31.75 50.48,33.97 50.48,35.43 Q1.2 50.61,36.32 53.97,39.69 C3.1
N$12
  Bottom 0.254: JP1.10 P3.5
N$13  (via drill 0.6)
  Top 0.254: USB2.GND 68.59,20.97 v67.63,21.59 | X1.GND 68.61,6.64 67.63,7.62 R7.2
  Bottom 0.254: v67.63,21.59 67.63,20.96 67.95,20.64 67.95,10.48 R7.2
N$16
  Top 0.254: C18.1 61.91,8.89 63.18,10.16 R6.2 64.14,10.48 65.72,12.06 66.04,12.06 67.31,13.33 72.55,13.33 USB2.GND@1
  Bottom 0.254: USB2.GND@1 USB2.GND@2
N$37  (via drill 0.6)
  Top 0.254: IC4.2 25.4,35.56 26.03,36.19 26.67,36.19 26.99,36.51 27.62,36.51 27.94,36.19 v31.43,36.19 | v31.43,30.48 IC4.9 | v30.48,40.64 38.42,40.64 39.05,41.27 41.91,41.27 42.86,42.23 48.58,42.23 49.53,43.18 R19.2
  Bottom 0.254: v31.43,30.48 31.43,30.8 31.12,31.11 31.12,34.92 31.43,35.24 v31.43,36.19 30.48,37.15 v30.48,40.64
PETCLK  (via drill 0.6)
  Top 0.254: CN1.6 9.45,32.63 10.8,33.97 13.33,33.97 P2.6 v20,32.7 | v33.02,66.04 SJ4.1 | v20,47.62 v33.02,47.62
  Bottom 0.254: v33.02,66.04 33.02,64.77 32.7,64.45 32.7,59.69 32.39,59.37 32.39,55.56 33.02,54.93 v33.02,47.62 | v20,32.7 v20,47.62
PETVICDATA/C64SEL  (via drill 0.6)
  Top 0.254: v16.19,49.53 SJ9.2 | v19.05,60.01 SJ3.1
  Bottom 0.254: CN1.M 7.58,52.43 9.84,50.16 9.84,47.62 P2.M 13.33,46.67 15.24,46.67 16.19,47.62 v16.19,49.53 16.19,57.15 v19.05,60.01
SCLK  (via drill 0.6)
  Top 0.254: IC1.6 v36.51,30.48 37.78,32.39 43.5,32.39 v43.82,32.07 | IC8.13 52.64,25.33 v52.39,25.08
  Bottom 0.254: v36.51,30.48 35.56,30.48 32.39,27.3 31.43,27.3 30.48,26.35 R5.1 | v52.39,25.08 44.45,25.08 43.5,26.04 43.5,31.11 43.82,31.43 v43.82,32.07
SPICLK  (via drill 0.6)
  Top 0.254: SJ1.1 16.19,66.99 17.14,67.94 36.83,67.94 37.15,68.26 38.74,68.26 39.05,67.94 v39.69,67.94 | v39.05,63.5 SJ4.2 | IC4.8 31.43,29.21 32.39,30.16 32.39,31.43 32.7,31.75 IC1.5 36.2,31.75 v36.51,32.07 | v39.05,60.01 SJ12.1 | v35.56,48.58 v39.05,48.58
  Bottom 0.254: v39.69,67.94 39.69,67.31 39.05,66.67 v39.05,63.5 v39.05,60.01 v39.05,48.58 | v36.51,32.07 34.92,33.66 34.92,41.91 35.56,42.55 v35.56,48.58
SPIMISO  (via drill 0.6)
  Top 0.254: IC4.1 26.03,36.83 27.94,39.05 32.07,39.05 32.7,38.42 33.34,38.42 33.97,37.78 v38.42,37.78 | v38.42,29.21 IC1.8 | v39.05,26.04 R9.2
  Bottom 0.254: v38.42,37.78 38.42,35.56 37.15,34.29 39.05,32.39 39.05,30.16 38.42,29.53 v38.42,29.21 38.42,27.3 39.05,26.67 v39.05,26.04
SPIMOSI  (via drill 0.6)
  Top 0.254: SJ2.1 17.78,60.01 20.32,57.47 SJ3.2 v25.72,57.47 | v32.07,34.29 IC1.3
  Bottom 0.254: v32.07,34.29 32.07,34.92 32.39,35.24 32.39,36.51 31.43,37.47 31.43,44.77 30.16,46.04 27.62,46.04 26.35,47.31 26.35,55.88 25.72,56.52 v25.72,57.47
TAPEREAD  (via drill 0.6)
  Top 0.254: SJ10.1 43.18,53.97 43.18,56.83 44.77,58.42 50.8,58.42 51.12,58.74 58.74,58.74 60.01,57.47 v70.17,57.47
  Bottom 0.254: P3.4 JP1.8 70.17,60.32 70.17,57.78 69.85,57.47 v70.17,57.47
TAPESENSE
  Top 0.254: SJ6.1 31.75,66.04 32.07,65.72 32.07,63.5 33.65,61.91 43.5,61.91 43.5,60.01 44.45,59.05 50.17,59.05 51.12,60.01 59.69,60.01 60.01,60.32 72.71,60.32 JP1.12
  Bottom 0.254: JP1.12 P3.6
VBCOMP  (via drill 0.6)
  Top 0.254: IC8.22 50.68,30.36 52.39,32.07 57.15,32.07 59.06,30.16 62.23,30.16 64.77,27.62 64.77,24.23 C15.1 65.09,23.81 66.68,22.22 C19.1 v66.68,17.78 69.82,17.78 USB2.VBUS | X1.VBUS 72.04,9.24 71.44,9.84 71.44,10.48 70.17,11.75 v66.99,11.75
  Bottom 0.254: v66.68,17.78 66.68,17.14 66.99,16.83 v66.99,11.75
VCC  (via drill 0.6)
  Top 0.254: 29.53,36.93 IC4.14 | v42.54,38.1 42.54,37.47
  Top 0.406: v28.26,38.1 29.53,38.1 29.53,36.93 | 42.54,37.47 41.91,36.83 IC1.14
  Top 0.61: C2.1 31.75,42.55 33.02,41.27 37.78,41.27 C4.1 40.64,42.55 R19.1 | C8.1 48.89,40.64 52.07,43.81 53.66,43.81 61.91,35.56 v61.91,32.07 | v25.4,53.97 SJ7.1
  Top 0.813: TO1.B 53.66,52.7 52.07,51.12 52.07,43.81
  Bottom 0.254: 28.26,41.59 28.1,41.75 | JP2.1 21.59,8.89 | C2.1
  Bottom 0.406: 28.26,41.59 v28.26,38.1 28.26,28.89 25.72,26.35 25.72,24.13 26.99,23.18 26.99,20.32 | 42.54,36.83 v42.54,38.1
  Bottom 0.61: C2.1 28.1,41.75 26.67,43.18 26.67,45.4 25.4,46.67 v25.4,53.97 | v42.54,38.1 42.54,39.05 | 42.54,39.05 C4.1 | 42.54,36.83 42.23,36.51 42.23,25.72 40.64,24.13 R9.1 R8.1 35.56,20.32 26.99,20.32 26.35,20.32 25.08,19.05 25.08,16.83 22.54,14.29 22.54,9.84 21.59,8.89 | C9.+ 16.51,8.89 JP2.1 | 42.54,39.05 42.54,39.69 43.5,40.64 C8.1 | v61.91,32.07 62.86,31.11 USB1.VBUS
  Bottom 0.813: 55.88,61.28 C5.1 47.31,61.28 C35.+ | 55.88,61.28 57.47,63.5 63.5,63.5 63.66,62.71 | 63.66,62.71 63.82,62.55 JP1.4 JP1.3 | P3.2 63.82,62.86 63.66,62.71 | 55.88,61.28 55.88,56.52 55.56,56.2 TO1.B

### Text on the board
Top: 1 | CBM-USB-V1.0A | (C) A. Fachat
tPlace: 1 | PET | C64 | VIC20 | CBM-USB-V1.0A | (C) A. Fachat